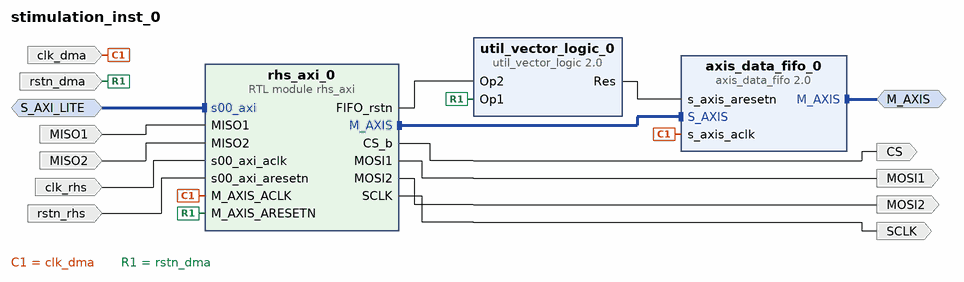
[diagram p0: block diagram of the top level]
# Vivado block design stimulation_inst_0, xck26-sfvc784-2LV-c, Vivado 2023.1
create_bd_design stimulation_inst_0

create_bd_intf_port -mode Master -vlnv xilinx.com:interface:axis_rtl:1.0 M_AXIS
create_bd_intf_port -mode Slave -vlnv xilinx.com:interface:aximm_rtl:1.0 S_AXI_LITE
create_bd_port -dir I -type clk clk_dma
create_bd_port -dir I MISO1
create_bd_port -dir I MISO2
create_bd_port -dir I -type clk clk_rhs
create_bd_port -dir I -type rst rstn_rhs
create_bd_port -dir I -type rst rstn_dma
create_bd_port -dir O CS
create_bd_port -dir O SCLK
create_bd_port -dir O MOSI1
create_bd_port -dir O MOSI2

create_bd_cell -type ip -vlnv xilinx.com:ip:util_vector_logic:2.0 util_vector_logic_0
set_property -dict {CONFIG.C_SIZE 1} [get_bd_cells util_vector_logic_0]
create_bd_cell -type ip -vlnv xilinx.com:ip:axis_data_fifo:2.0 axis_data_fifo_0
set_property -dict {CONFIG.FIFO_DEPTH 32768 CONFIG.HAS_TLAST 1 CONFIG.TDATA_NUM_BYTES 8} [get_bd_cells axis_data_fifo_0]
create_bd_cell -type module -reference rhs_axi rhs_axi_0

# ---- connections ----

connect_bd_intf_net [get_bd_intf_pins rhs_axi_0/s00_axi] [get_bd_intf_ports S_AXI_LITE]
connect_bd_intf_net [get_bd_intf_pins axis_data_fifo_0/M_AXIS] [get_bd_intf_ports M_AXIS]
connect_bd_intf_net [get_bd_intf_pins rhs_axi_0/M_AXIS] [get_bd_intf_pins axis_data_fifo_0/S_AXIS]
connect_bd_net -net MISO1_1 [get_bd_ports MISO1] [get_bd_pins rhs_axi_0/MISO1]
connect_bd_net -net MISO2_1 [get_bd_ports MISO2] [get_bd_pins rhs_axi_0/MISO2]
connect_bd_net [get_bd_ports clk_dma] [get_bd_pins axis_data_fifo_0/s_axis_aclk] [get_bd_pins rhs_axi_0/M_AXIS_ACLK]
connect_bd_net [get_bd_ports clk_rhs] [get_bd_pins rhs_axi_0/s00_axi_aclk]
connect_bd_net [get_bd_pins rhs_axi_0/CS_b] [get_bd_ports CS]
connect_bd_net [get_bd_pins rhs_axi_0/FIFO_rstn] [get_bd_pins util_vector_logic_0/Op2]
connect_bd_net [get_bd_pins rhs_axi_0/MOSI1] [get_bd_ports MOSI1]
connect_bd_net [get_bd_pins rhs_axi_0/MOSI2] [get_bd_ports MOSI2]
connect_bd_net [get_bd_pins rhs_axi_0/SCLK] [get_bd_ports SCLK]
connect_bd_net [get_bd_ports rstn_dma] [get_bd_pins util_vector_logic_0/Op1] [get_bd_pins rhs_axi_0/M_AXIS_ARESETN]
connect_bd_net [get_bd_ports rstn_rhs] [get_bd_pins rhs_axi_0/s00_axi_aresetn]
connect_bd_net [get_bd_pins util_vector_logic_0/Res] [get_bd_pins axis_data_fifo_0/s_axis_aresetn]

# ---- address map ----
assign_bd_address -offset 0x0000 -range 64K -target_address_space [get_bd_addr_spaces S_AXI_LITE] [get_bd_addr_segs rhs_axi_0/s00_axi/reg0]

validate_bd_design
save_bd_design
